# Altium project ShieldCerveau.PrjPcb
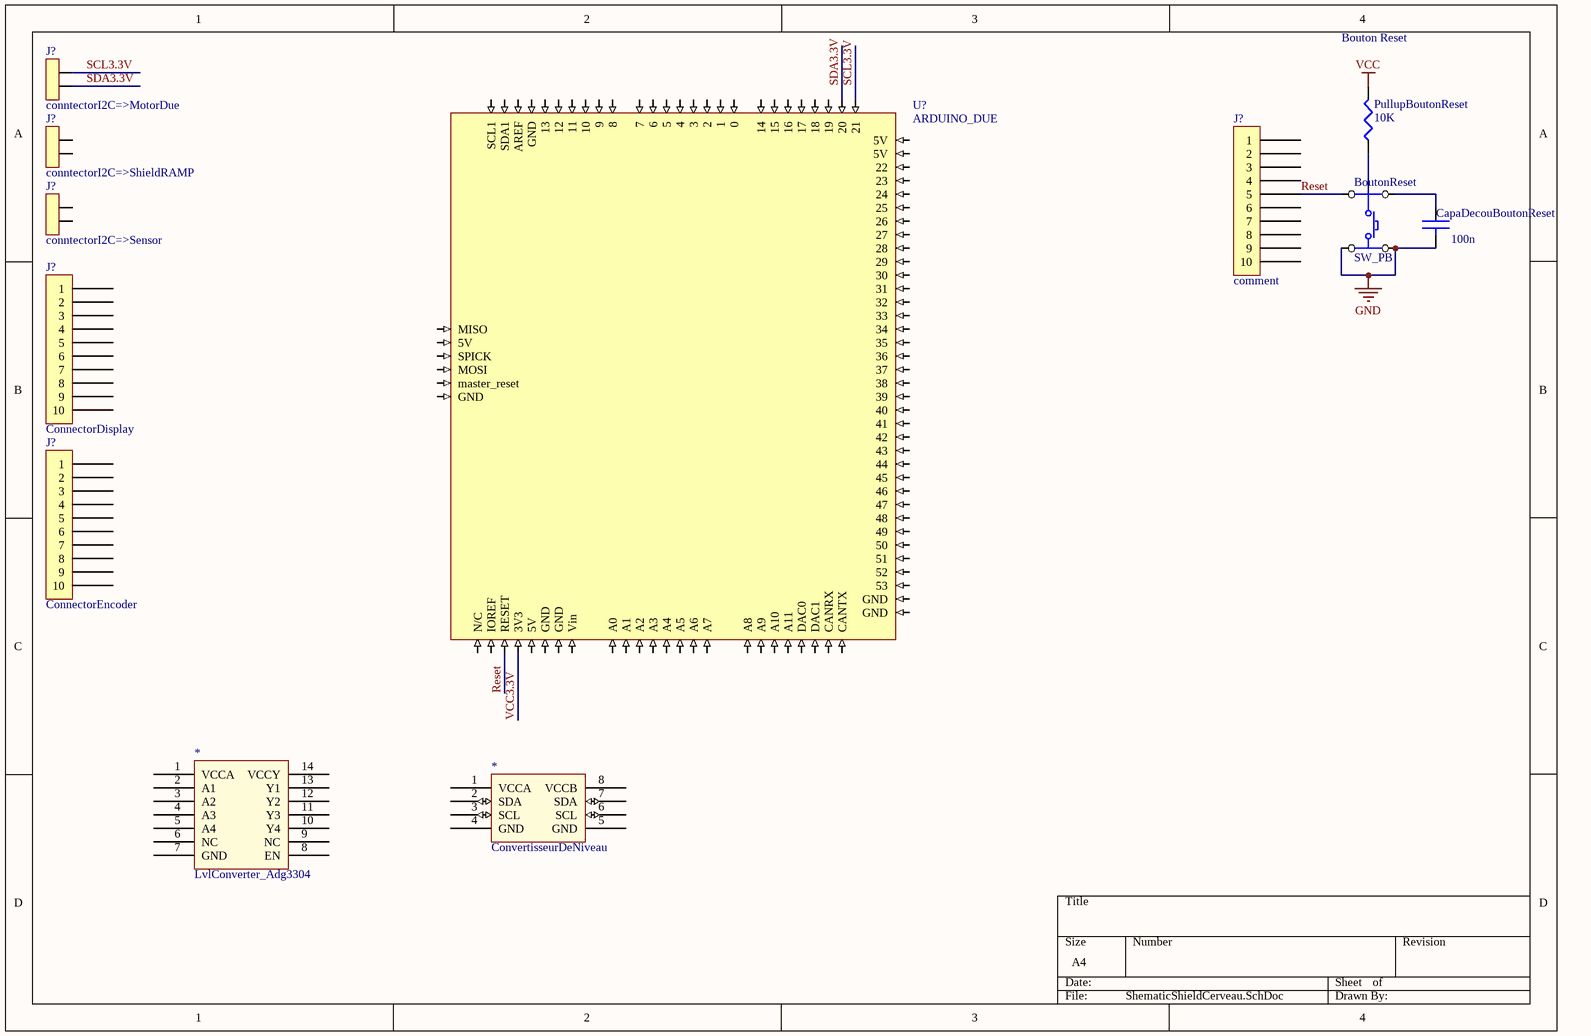
[diagram p0: ShematicShieldCerveau.SchDoc]
1 sheet, 12 parts. Net scope: global (net labels, ports and power ports of the same name join across sheets).

## Sheet ShematicShieldCerveau.SchDoc
size A4

### Parts
(Parts that share a designator on the sheet are numbered #1, #2 ... from top to bottom, then left to right.)
*#1  LvlConverter_Adg3304  [LvlConverter_Adg3304]
*#2  ConvertisseurDeNiveau
BoutonReset  SW_PB  [KSA]
CapaDecouBoutonReset  value 100n  [0805]  (hidden comment: CAP)
J?#1  conntectorI2C=>MotorDue  [AMP_2]
J?#2  conntectorI2C=>ShieldRAMP  [AMP_2]
J?#3  conntectorI2C=>Sensor  [AMP_2]
J?#4  comment  [HE10-10V]
J?#5  ConnectorDisplay  [HE10-10V]
J?#6  ConnectorEncoder  [HE10-10V]
PullupBoutonReset  value 10K  [0805]  (hidden comment: RES)
U?  ARDUINO_DUE  [ARDUINO_DUE]

### Nets
GND: BoutonReset.3 BoutonReset.4 CapaDecouBoutonReset.2
VCC: PullupBoutonReset.2
Reset: BoutonReset.2 J?#4.5 U?.84(RESET)
SCL3.3V: J?#1.1 U?.26(21)
SDA3.3V: J?#1.2 U?.25(20)
VCC3.3V: U?.83(3V3)
NetBoutonReset_1: BoutonReset.1 CapaDecouBoutonReset.1

Not connected (* = marked no-connect by the designer): *#1 1(VCCA) 2(A1) 3(A2) 4(A3) 5(A4) 6(NC) 7(GND) 8(EN) 9(NC) 10(Y4) 11(Y3) 12(Y2) 13(Y1) 14(VCCY); *#2 1(VCCA) 2(SDA) 3(SCL) 4(GND) 5(GND) 6(SCL) 7(SDA) 8(VCCB); J?#2 1 2; J?#3 1 2; J?#4 1 2 3 4 6 7 8 9 10; J?#5 1 2 3 4 5 6 7 8 9 10; J?#6 1 2 3 4 5 6 7 8 9 10; PullupBoutonReset 1; U? 1(SCL1) 2(SDA1) 3(AREF) 4(GND) 5(13) 6(12) 7(11) 8(10) 9 10(8) 11(7) 12(6) 13(5) 14(4) 15(3) 16(2) 17(1) 18(0) 19(14) 20(15) 21(16) 22(17) 23(18) 24(19) 27(5V) 28(5V) 29(22) 30(23) 31(24) 32(25) 33(26) 34(27) 35(28) 36(29) 37(30) 38(31) 39(32) 40(33) 41(34) 42(35) 43(36) 44(37) 45(38) 46(39) 47(40) 48(41) 49(42) 50(43) 51(44) 52(45) 53(46) 54(47) 55(48) 56(49) 57(50) 58(51) 59(52) 60(53) 61(GND) 62(GND) 63(CANTX) 64(CANRX) 65(DAC1) 66(DAC0) 67(A11) 68(A10) 69(A9) 70(A8) 71(A7) 72(A6) 73(A5) 74(A4) 75(A3) 76(A2) 77(A1) 78(A0) 79(Vin) 80(GND) 81(GND) 82(5V) 85(IOREF) 86(N/C) 87(MISO) 88(5V) 89(SPICK) 90(MOSI) 91(master_reset) 92(GND)

### Notes on the sheet
- Bouton Reset

### Library data of the parts
CapaDecouBoutonReset = CAP: capacité non polarisée
J?#1-J?#3 = POWER2: connecteur alim 2 pôles
J?#4-J?#6 = HE10-10: 10-pin connector
PullupBoutonReset = RES: resistance